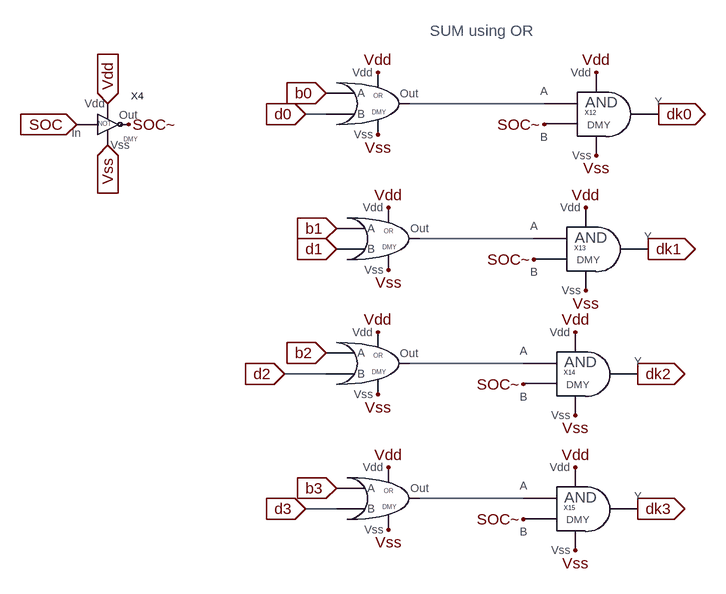
[diagram p0: schematic SUM.asc]
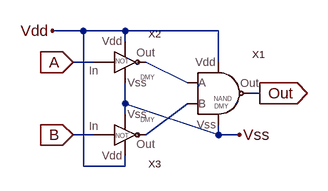
[diagram p1: sub-circuit or.asc]
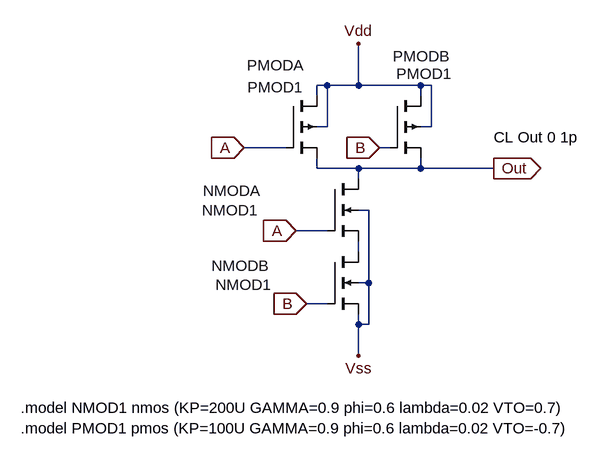
[diagram p2: sub-circuit nand.asc]
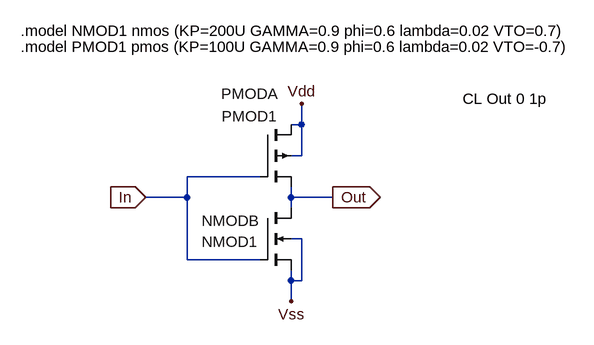
[diagram p3: sub-circuit not.asc]
SUM.asc, the LTspice schematic file:
Version 4
SHEET 1 2408 1692
WIRE 1200 -752 992 -752
WIRE 864 -736 832 -736
WIRE 1184 -544 1008 -544
WIRE 896 -528 880 -528
WIRE 1168 -352 992 -352
WIRE 864 -336 800 -336
WIRE 1168 -144 1008 -144
WIRE 880 -128 832 -128
FLAG 960 -496 Vss
FLAG 944 -704 Vss
FLAG 944 -800 Vdd
FLAG 960 -592 Vdd
FLAG 864 -768 b0
IOPIN 864 -768 In
FLAG 880 -560 b1
IOPIN 880 -560 In
FLAG 1376 -736 dk0
IOPIN 1376 -736 Out
FLAG 1360 -528 dk1
IOPIN 1360 -528 Out
FLAG 960 -96 Vss
FLAG 944 -304 Vss
FLAG 944 -400 Vdd
FLAG 960 -192 Vdd
FLAG 864 -368 b2
IOPIN 864 -368 In
FLAG 880 -160 b3
IOPIN 880 -160 In
FLAG 1344 -336 dk2
IOPIN 1344 -336 Out
FLAG 1344 -128 dk3
IOPIN 1344 -128 Out
FLAG 832 -128 d3
IOPIN 832 -128 In
FLAG 800 -336 d2
IOPIN 800 -336 In
FLAG 832 -736 d0
IOPIN 832 -736 In
FLAG 880 -528 d1
IOPIN 880 -528 In
FLAG 1248 -192 Vdd
FLAG 1248 -400 Vdd
FLAG 1264 -592 Vdd
FLAG 1280 -800 Vdd
FLAG 1280 -672 Vss
FLAG 1264 -464 Vss
FLAG 1248 -272 Vss
FLAG 1248 -64 Vss
FLAG 1200 -720 SOC~
FLAG 1184 -512 SOC~
FLAG 1168 -320 SOC~
FLAG 1168 -112 SOC~
FLAG 528 -752 Vdd
IOPIN 528 -752 In
FLAG 528 -688 Vss
IOPIN 528 -688 In
FLAG 560 -720 SOC~
FLAG 480 -720 SOC
IOPIN 480 -720 In
SYMBOL OR 880 -752 R0
WINDOW 0 0 0 Invisible 0
SYMATTR InstName X1
SYMBOL OR 896 -544 R0
WINDOW 0 0 0 Invisible 0
SYMATTR InstName X3
SYMBOL OR 880 -352 R0
WINDOW 0 0 0 Invisible 0
SYMATTR InstName X2
SYMBOL OR 896 -144 R0
WINDOW 0 0 0 Invisible 0
SYMATTR InstName X9
SYMBOL AND 1312 -736 R0
SYMATTR InstName X12
SYMBOL AND 1296 -528 R0
SYMATTR InstName X13
SYMBOL AND 1280 -336 R0
SYMATTR InstName X14
SYMBOL AND 1280 -128 R0
SYMATTR InstName X15
SYMBOL not 512 -720 R0
SYMATTR InstName X4
TEXT 1024 -864 Left 2 ;SUM using OR

or.asc, the sub-circuit schematic file:
Version 4
SHEET 1 880 680
WIRE 48 64 0 64
WIRE 112 64 48 64
WIRE 256 64 112 64
WIRE 112 80 112 64
WIRE 64 112 32 112
WIRE 256 112 256 64
WIRE 208 144 144 112
WIRE 320 160 304 160
WIRE 112 176 112 144
WIRE 112 192 112 176
WIRE 64 224 32 224
WIRE 144 224 208 176
WIRE 256 224 112 176
WIRE 256 224 256 208
WIRE 288 224 256 224
WIRE 48 272 48 64
WIRE 112 272 112 256
WIRE 112 272 48 272
FLAG 32 112 A
IOPIN 32 112 In
FLAG 32 224 B
IOPIN 32 224 In
FLAG 320 160 Out
IOPIN 320 160 Out
FLAG 0 64 Vdd
FLAG 288 224 Vss
SYMBOL NAND 224 160 R0
SYMATTR InstName X1
SYMBOL NOT 96 112 R0
SYMATTR InstName X2
SYMBOL NOT 96 224 M180
SYMATTR InstName X3

nand.asc, the sub-circuit schematic file:
Version 4
SHEET 1 880 680
WIRE 272 -32 256 -32
WIRE 320 -32 320 -96
WIRE 320 -32 272 -32
WIRE 416 -32 320 -32
WIRE 432 -32 416 -32
WIRE 256 -16 256 -32
WIRE 416 -16 416 -32
WIRE 272 32 272 -32
WIRE 272 32 256 32
WIRE 432 32 432 -32
WIRE 432 32 416 32
WIRE 208 64 144 64
WIRE 368 64 352 64
WIRE 256 96 256 80
WIRE 320 96 256 96
WIRE 416 96 416 80
WIRE 416 96 320 96
WIRE 528 96 416 96
WIRE 320 112 320 96
WIRE 336 160 320 160
WIRE 272 192 224 192
WIRE 320 224 320 208
WIRE 336 272 336 160
WIRE 336 272 320 272
WIRE 272 304 240 304
WIRE 320 336 320 320
WIRE 336 336 336 272
WIRE 336 336 320 336
WIRE 320 384 320 336
FLAG 144 64 A
IOPIN 144 64 In
FLAG 224 192 A
IOPIN 224 192 In
FLAG 352 64 B
IOPIN 352 64 In
FLAG 240 304 B
IOPIN 240 304 In
FLAG 528 96 Out
IOPIN 528 96 Out
FLAG 320 384 Vss
FLAG 320 -96 Vdd
SYMBOL pmos4 208 -16 R0
WINDOW 0 -60 -47 Left 2
WINDOW 3 -59 -13 Left 2
SYMATTR InstName PMODA
SYMATTR Value PMOD1
SYMATTR Value2 l=1u w=50u
SYMBOL pmos4 368 -16 R0
WINDOW 0 5 -61 Left 2
WINDOW 3 10 -34 Left 2
SYMATTR InstName PMODB
SYMATTR Value PMOD1
SYMATTR Value2 l=1u w=50u
SYMBOL nmos4 272 112 R0
WINDOW 0 -191 18 Left 2
WINDOW 3 -193 48 Left 2
SYMATTR InstName NMODA
SYMATTR Value NMOD1
SYMATTR Value2 l=1u w=50u
SYMBOL nmos4 272 224 R0
WINDOW 0 -178 22 Left 2
WINDOW 3 -172 51 Left 2
SYMATTR InstName NMODB
SYMATTR Value NMOD1
SYMATTR Value2 l=1u w=100u
TEXT -200 464 Left 2 !.model NMOD1 nmos (KP=200U GAMMA=0.9 phi=0.6 lambda=0.02 VTO=0.7)
TEXT -200 496 Left 2 !.model PMOD1 pmos (KP=100U GAMMA=0.9 phi=0.6 lambda=0.02 VTO=-0.7)
TEXT 528 48 Left 2 !CL Out 0 1p

not.asc, the sub-circuit schematic file:
Version 4
SHEET 1 880 680
WIRE 288 -96 288 -128
WIRE 288 -96 272 -96
WIRE 288 -48 288 -96
WIRE 288 -48 272 -48
WIRE 224 -16 112 -16
WIRE 112 16 112 -16
WIRE 112 16 48 16
WIRE 272 16 272 0
WIRE 336 16 272 16
WIRE 272 32 272 16
WIRE 112 112 112 16
WIRE 288 80 272 80
WIRE 224 112 112 112
WIRE 272 144 272 128
WIRE 288 144 288 80
WIRE 288 144 272 144
WIRE 272 176 272 144
FLAG 48 16 In
IOPIN 48 16 In
FLAG 336 16 Out
IOPIN 336 16 Out
FLAG 272 176 Vss
FLAG 288 -128 Vdd
SYMBOL pmos4 224 -96 R0
WINDOW 0 -60 -47 Left 2
WINDOW 3 -59 -13 Left 2
SYMATTR InstName PMODA
SYMATTR Value PMOD1
SYMATTR Value2 l=1u w=50u
SYMBOL nmos4 224 32 R0
WINDOW 0 -90 20 Left 2
WINDOW 3 -90 52 Left 2
SYMATTR InstName NMODB
SYMATTR Value NMOD1
SYMATTR Value2 l=1u w=100u
TEXT -144 -240 Left 2 !.model NMOD1 nmos (KP=200U GAMMA=0.9 phi=0.6 lambda=0.02 VTO=0.7)
TEXT -144 -216 Left 2 !.model PMOD1 pmos (KP=100U GAMMA=0.9 phi=0.6 lambda=0.02 VTO=-0.7)
TEXT 536 -136 Left 2 !CL Out 0 1p

The netlist it stands for:
* SUM.asc
XX1 Vdd Vss N001 b0 d0 or
XX3 Vdd Vss N002 b1 d1 or
XX2 Vdd Vss N003 b2 d2 or
XX9 Vdd Vss N004 b3 d3 or
XX12 N001 SOC~ Vss Vdd dk0 AND  ; pins A B Vss Vdd Y
XX13 N002 SOC~ Vss Vdd dk1 AND  ; pins A B Vss Vdd Y
XX14 N003 SOC~ Vss Vdd dk2 AND  ; pins A B Vss Vdd Y
XX15 N004 SOC~ Vss Vdd dk3 AND  ; pins A B Vss Vdd Y
XX4 Vdd Vss SOC SOC~ not

* block symbol definitions
.subckt or Vdd Vss Out A B
XX1 N001 N002 Out Vss Vdd nand
XX2 Vdd Vss A N001 not
XX3 Vdd Vss B N002 not
.ends or

.subckt nand A B Out Vss Vdd
M§PMODA Vdd A Out Vdd PMOD1 l=1u w=50u
M§PMODB Vdd B Out Vdd PMOD1 l=1u w=50u
M§NMODA Out A N001 Vss NMOD1 l=1u w=50u
M§NMODB N001 B Vss Vss NMOD1 l=1u w=100u
.model NMOD1 nmos (KP=200U GAMMA=0.9 phi=0.6 lambda=0.02 VTO=0.7)
.model PMOD1 pmos (KP=100U GAMMA=0.9 phi=0.6 lambda=0.02 VTO=-0.7)
CL Out 0 1p
.ends nand

.subckt not Vdd Vss In Out
M§PMODA Vdd In Out Vdd PMOD1 l=1u w=50u
M§NMODB Out In Vss Vss NMOD1 l=1u w=100u
.model NMOD1 nmos (KP=200U GAMMA=0.9 phi=0.6 lambda=0.02 VTO=0.7)
.model PMOD1 pmos (KP=100U GAMMA=0.9 phi=0.6 lambda=0.02 VTO=-0.7)
CL Out 0 1p
.ends not

.model NMOS NMOS
.model PMOS PMOS
.lib standard.mos
* SUM using OR
.backanno
.end